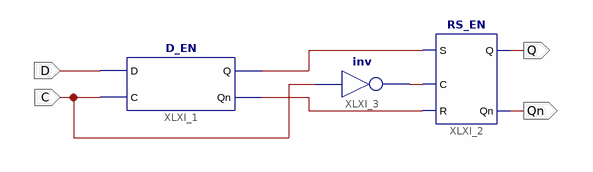
[diagram p0: schematic sheet 1]
// Xilinx ISE schematic D_Trig.sch (kintex7) as structural Verilog: 3 symbols, 4 ports
module D_Trig (
  input  C,
  input  D,
  output Q,
  output Qn
);

  wire XLXN_1, XLXN_6, XLXN_7;

  D_EN XLXI_1 (.D(D), .C(C), .Q(XLXN_7), .Qn(XLXN_6));
  RS_EN XLXI_2 (.Q(Q), .Qn(Qn), .C(XLXN_1), .S(XLXN_7), .R(XLXN_6));
  not XLXI_3 (XLXN_1, C);
endmodule
